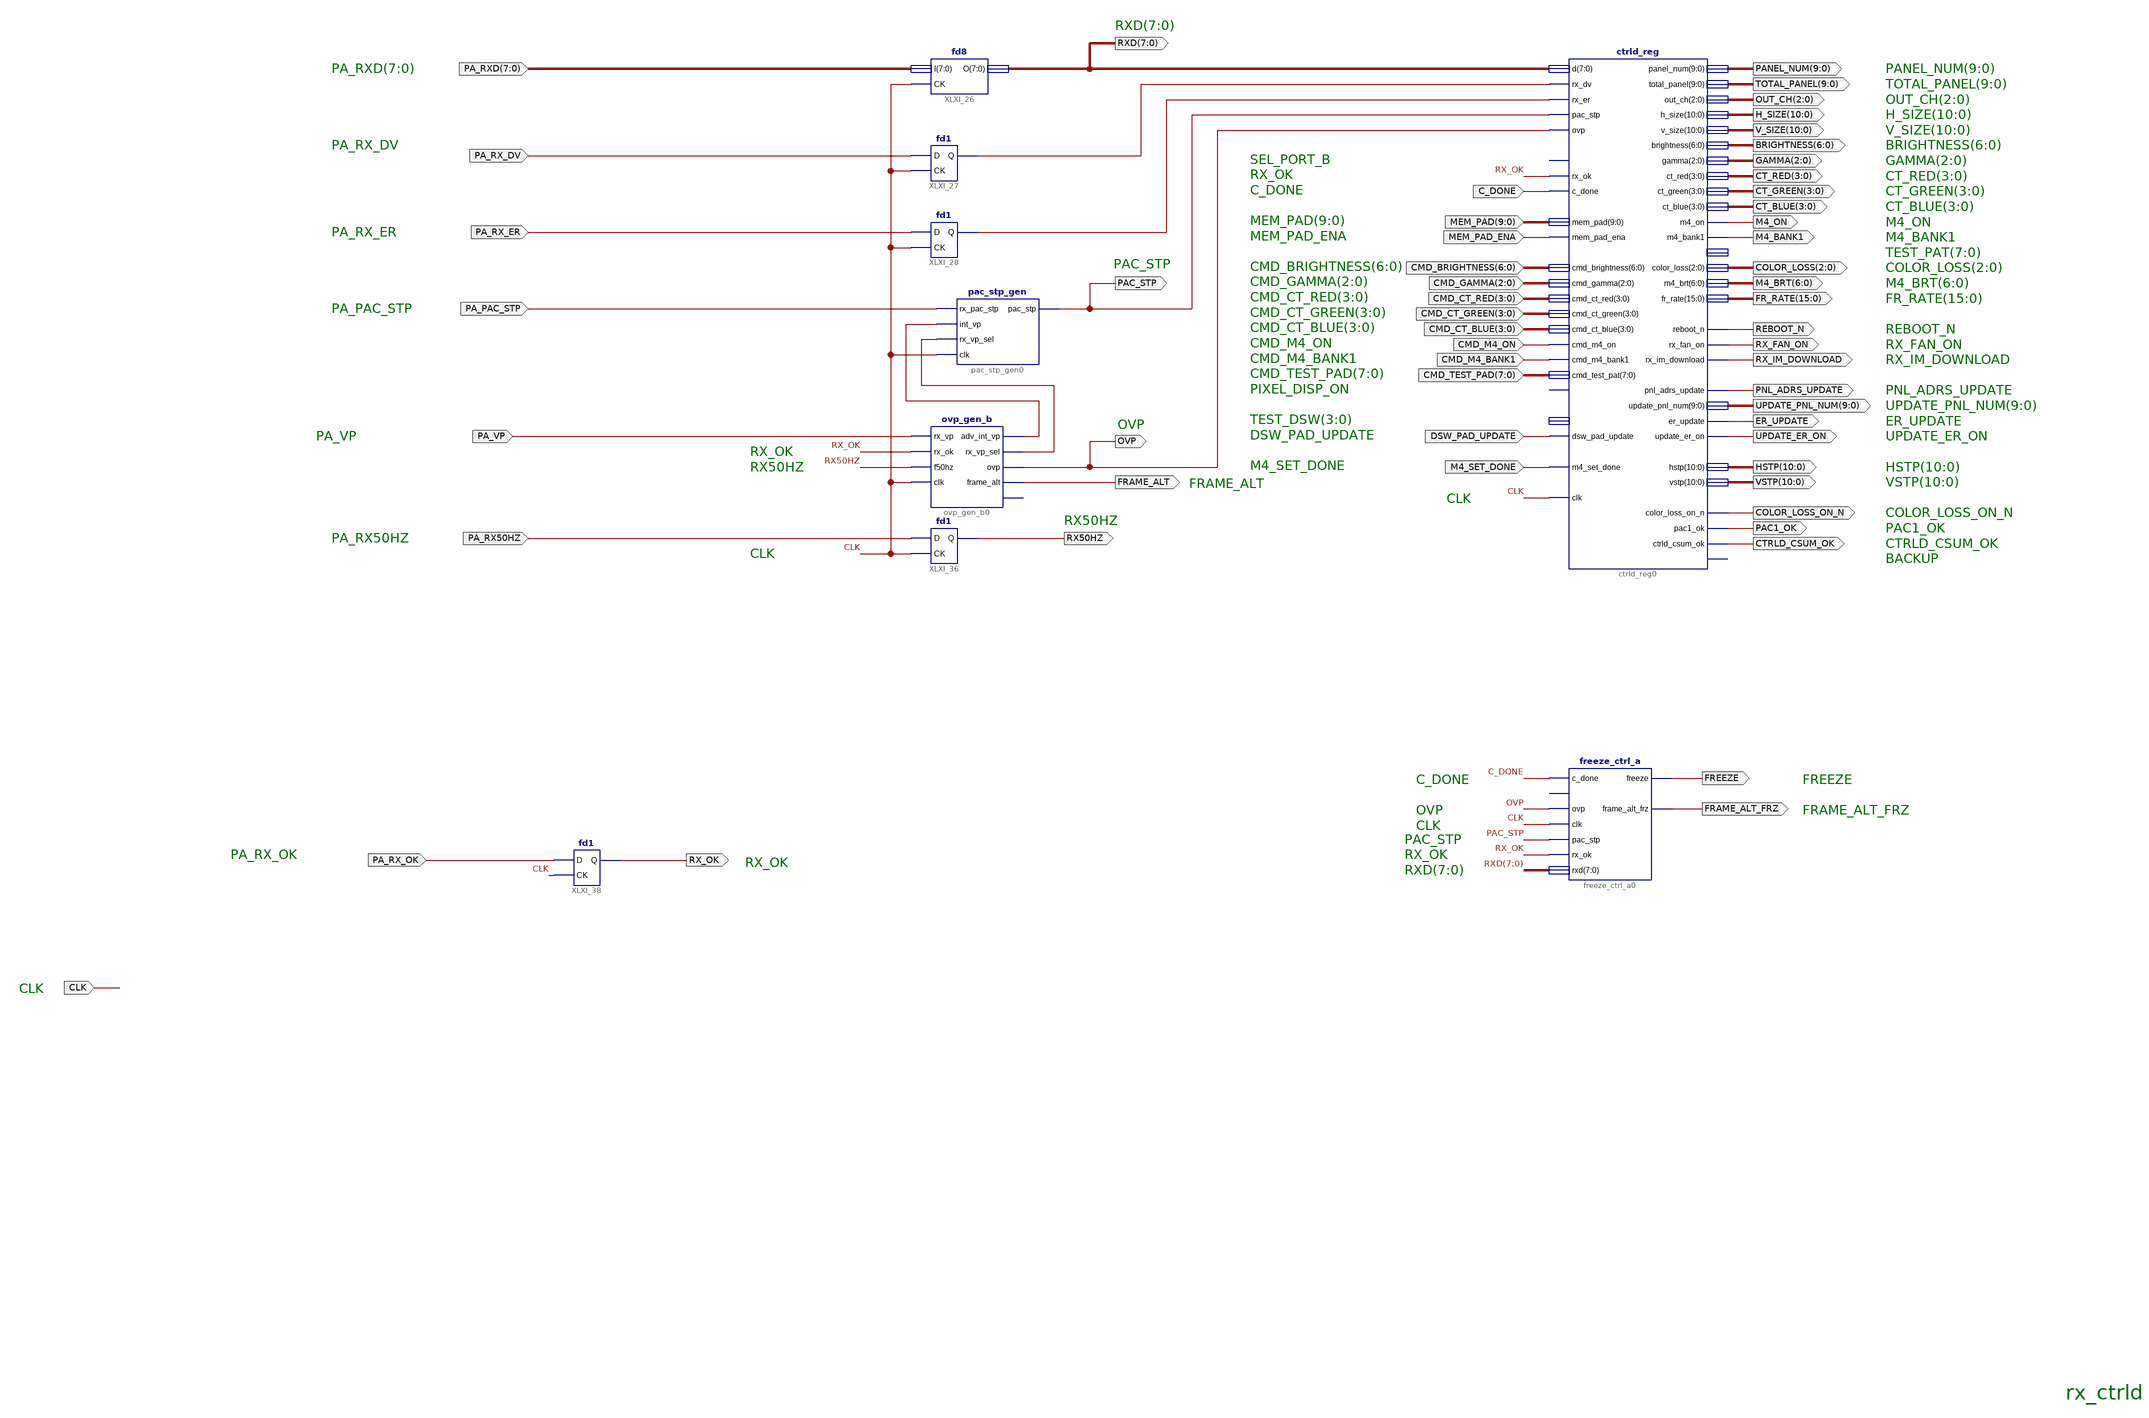
[diagram p0: schematic sheet 1]
// Xilinx ISE schematic rx_ctrld.sch (aspartan6) as structural Verilog: 9 symbols, 56 ports
module rx_ctrld (
  input  CLK,
  input  [7:0] PA_RXD,
  input  C_DONE,
  input  [6:0] CMD_BRIGHTNESS,
  input  [2:0] CMD_GAMMA,
  input  [3:0] CMD_CT_RED,
  input  [3:0] CMD_CT_GREEN,
  input  [3:0] CMD_CT_BLUE,
  input  [7:0] CMD_TEST_PAD,
  input  DSW_PAD_UPDATE,
  input  CMD_M4_BANK1,
  input  CMD_M4_ON,
  input  MEM_PAD_ENA,
  input  M4_SET_DONE,
  input  PA_RX_DV,
  input  PA_RX_ER,
  input  PA_PAC_STP,
  input  PA_VP,
  input  PA_RX50HZ,
  input  PA_RX_OK,
  input  [9:0] MEM_PAD,
  output RX_OK,
  output OVP,
  output PAC_STP,
  output [7:0] RXD,
  output [9:0] PANEL_NUM,
  output [9:0] TOTAL_PANEL,
  output [2:0] OUT_CH,
  output [10:0] H_SIZE,
  output [10:0] V_SIZE,
  output [6:0] BRIGHTNESS,
  output [2:0] GAMMA,
  output [3:0] CT_RED,
  output [3:0] CT_GREEN,
  output [3:0] CT_BLUE,
  output M4_ON,
  output M4_BANK1,
  output [2:0] COLOR_LOSS,
  output [6:0] M4_BRT,
  output RX50HZ,
  output FRAME_ALT,
  output [9:0] UPDATE_PNL_NUM,
  output REBOOT_N,
  output RX_FAN_ON,
  output RX_IM_DOWNLOAD,
  output PNL_ADRS_UPDATE,
  output ER_UPDATE,
  output UPDATE_ER_ON,
  output [10:0] HSTP,
  output [10:0] VSTP,
  output COLOR_LOSS_ON_N,
  output PAC1_OK,
  output CTRLD_CSUM_OK,
  output [15:0] FR_RATE,
  output FRAME_ALT_FRZ,
  output FREEZE
);

  wire XLXN_216, XLXN_218, XLXN_274, XLXN_275;

  fd8 XLXI_26 (.I(PA_RXD), .CK(CLK), .O(RXD));
  fd1 XLXI_28 (.D(PA_RX_ER), .CK(CLK), .Q(XLXN_216));
  fd1 XLXI_27 (.D(PA_RX_DV), .CK(CLK), .Q(XLXN_218));
  fd1 XLXI_36 (.D(PA_RX50HZ), .CK(CLK), .Q(RX50HZ));
  pac_stp_gen pac_stp_gen0 (
    .pac_stp(PAC_STP), .rx_pac_stp(PA_PAC_STP), .int_vp(XLXN_274), .rx_vp_sel(XLXN_275), .clk(CLK));
  ctrld_reg ctrld_reg0 (
    .ovp(OVP), .pac_stp(PAC_STP), .rx_dv(XLXN_218), .rx_er(XLXN_216), .c_done(C_DONE), .rx_ok(RX_OK),
    .clk(CLK), .mem_pad_ena(MEM_PAD_ENA), .dsw_pad_update(DSW_PAD_UPDATE), .cmd_m4_on(CMD_M4_ON),
    .cmd_m4_bank1(CMD_M4_BANK1), .m4_set_done(M4_SET_DONE), .d(RXD), .mem_pad(MEM_PAD),
    .cmd_test_pat(CMD_TEST_PAD), .cmd_brightness(CMD_BRIGHTNESS), .cmd_gamma(CMD_GAMMA),
    .cmd_ct_red(CMD_CT_RED), .cmd_ct_green(CMD_CT_GREEN), .cmd_ct_blue(CMD_CT_BLUE),
    .ctrld_csum_ok(CTRLD_CSUM_OK), .rx_fan_on(RX_FAN_ON), .rx_im_download(RX_IM_DOWNLOAD), .pac1_ok(PAC1_OK),
    .pnl_adrs_update(PNL_ADRS_UPDATE), .reboot_n(REBOOT_N), .er_update(ER_UPDATE),
    .update_er_on(UPDATE_ER_ON), .color_loss_on_n(COLOR_LOSS_ON_N), .m4_on(M4_ON), .m4_bank1(M4_BANK1),
    .total_panel(TOTAL_PANEL), .out_ch(OUT_CH), .h_size(H_SIZE), .v_size(V_SIZE), .color_loss(COLOR_LOSS),
    .panel_num(PANEL_NUM), .update_pnl_num(UPDATE_PNL_NUM), .hstp(HSTP), .vstp(VSTP),
    .brightness(BRIGHTNESS), .gamma(GAMMA), .ct_red(CT_RED), .ct_green(CT_GREEN), .ct_blue(CT_BLUE),
    .m4_brt(M4_BRT), .fr_rate(FR_RATE));  // open: sel_port_b, pixel_disp_on, test_dsw, test_pat, backup
  fd1 XLXI_38 (.D(PA_RX_OK), .CK(CLK), .Q(RX_OK));
  ovp_gen_b ovp_gen_b0 (
    .f50hz(RX50HZ), .rx_ok(RX_OK), .rx_vp(PA_VP), .clk(CLK), .ovp(OVP), .frame_alt(FRAME_ALT),
    .adv_int_vp(XLXN_274), .rx_vp_sel(XLXN_275));  // open: over_vp
  freeze_ctrl_a freeze_ctrl_a0 (
    .c_done(C_DONE), .ovp(OVP), .clk(CLK), .freeze(FREEZE), .frame_alt_frz(FRAME_ALT_FRZ), .pac_stp(PAC_STP),
    .rx_ok(RX_OK), .rxd(RXD));  // open: sel_port_chngp

  // Notes on the sheet:
  //   RXD(7:0)
  //   PA_RXD(7:0)
  //   PANEL_NUM(9:0)
  //   TOTAL_PANEL(9:0)
  //   OUT_CH(2:0)
  //   H_SIZE(10:0)
  //   V_SIZE(10:0)
  //   PA_RX_DV
  //   BRIGHTNESS(6:0)
  //   SEL_PORT_B
  //   GAMMA(2:0)
  //   RX_OK
  //   CT_RED(3:0)
  //   C_DONE
  //   CT_GREEN(3:0)
  //   CT_BLUE(3:0)
  //   MEM_PAD(9:0)
  //   M4_ON
  //   PA_RX_ER
  //   MEM_PAD_ENA
  //   M4_BANK1
  //   TEST_PAT(7:0)
  //   PAC_STP
  //   CMD_BRIGHTNESS(6:0)
  //   COLOR_LOSS(2:0)
  //   CMD_GAMMA(2:0)
  //   M4_BRT(6:0)
  //   CMD_CT_RED(3:0)
  //   FR_RATE(15:0)
  //   PA_PAC_STP
  //   CMD_CT_GREEN(3:0)
  //   CMD_CT_BLUE(3:0)
  //   REBOOT_N
  //   CMD_M4_ON
  //   RX_FAN_ON
  //   CMD_M4_BANK1
  //   RX_IM_DOWNLOAD
  //   CMD_TEST_PAD(7:0)
  //   PIXEL_DISP_ON
  //   PNL_ADRS_UPDATE
  //   UPDATE_PNL_NUM(9:0)
  //   TEST_DSW(3:0)
  //   ER_UPDATE
  //   OVP
  //   DSW_PAD_UPDATE
  //   PA_VP
  //   UPDATE_ER_ON
  //   RX_OK
  //   M4_SET_DONE
  //   RX50HZ
  //   HSTP(10:0)
  //   VSTP(10:0)
  //   FRAME_ALT
  //   CLK
  //   COLOR_LOSS_ON_N
  //   RX50HZ
  //   PAC1_OK
  //   PA_RX50HZ
  //   CTRLD_CSUM_OK
  //   CLK
  //   BACKUP
  //   C_DONE
  //   FREEZE
  //   OVP
  //   FRAME_ALT_FRZ
  //   CLK
  //   PAC_STP
  //   PA_RX_OK
  //   RX_OK
  //   RX_OK
  //   RXD(7:0)
  //   CLK
  //   rx_ctrld
endmodule
